# Altium schematic sheet Electronics_Instrumentation.SchDoc
size A; SheetNumber: 1; SheetTotal: 1
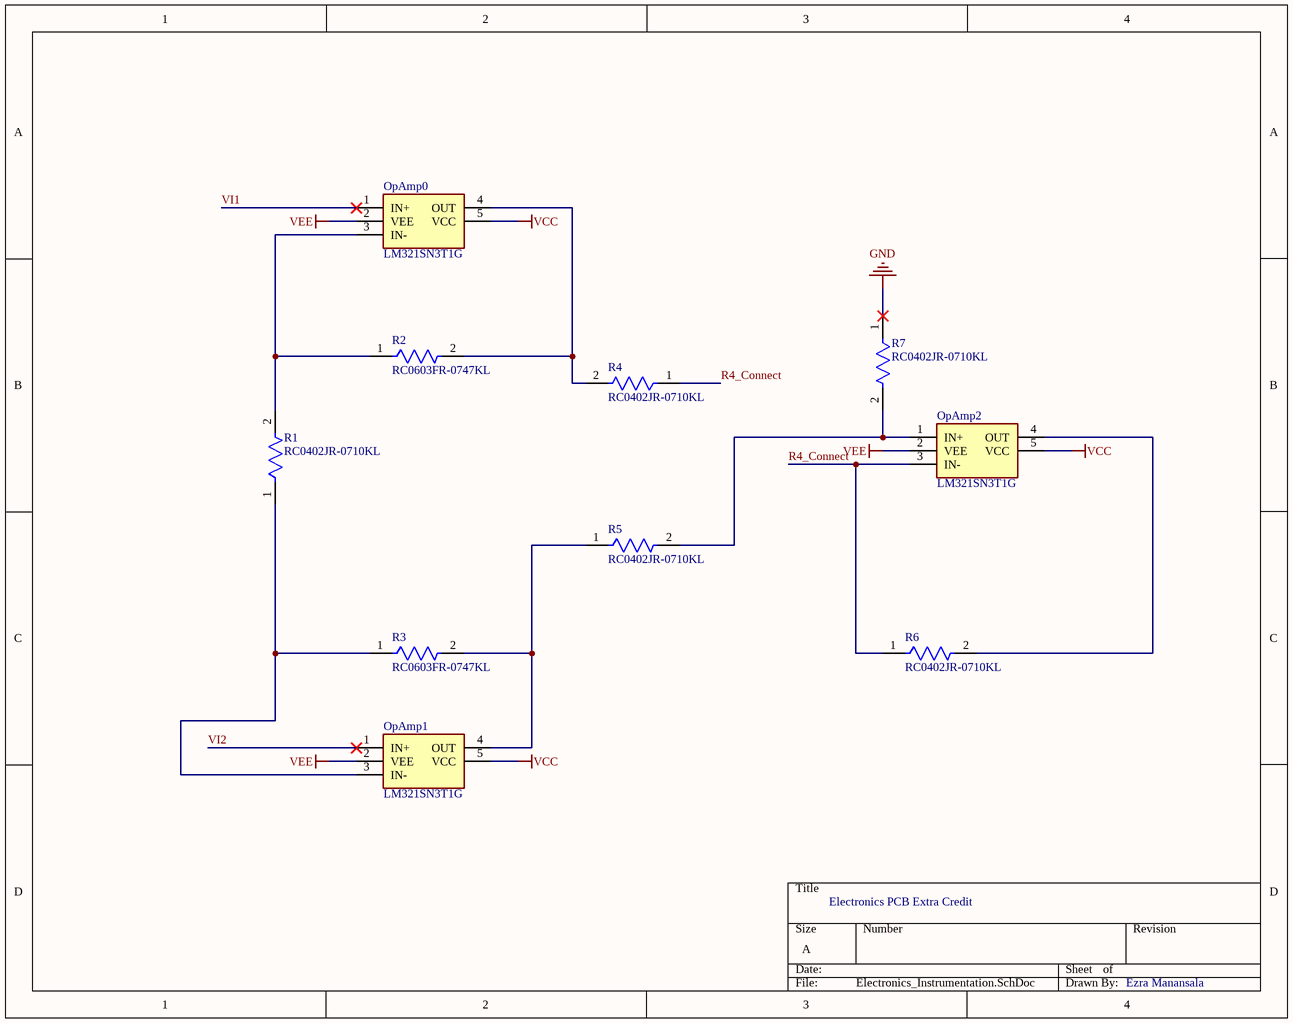
[diagram p0: Electronics_Instrumentation.SchDoc]

## Parts
OpAmp0  LM321SN3T1G  [SOT95P275X110-5N]
OpAmp1  LM321SN3T1G  [SOT95P275X110-5N]
OpAmp2  LM321SN3T1G  [SOT95P275X110-5N]
R1  RC0402JR-0710KL  [FP-RC0402-0_4-IPC_C]
R2  RC0603FR-0747KL  [FP-RC0603FR-0747KL-MFG]
R3  RC0603FR-0747KL  [FP-RC0603FR-0747KL-MFG]
R4  RC0402JR-0710KL  [FP-RC0402-0_4-IPC_C]
R5  RC0402JR-0710KL  [FP-RC0402-0_4-IPC_C]
R6  RC0402JR-0710KL  [FP-RC0402-0_4-IPC_C]
R7  RC0402JR-0710KL  [FP-RC0402-0_4-IPC_C]

## Nets
GND: R7.1
VCC: OpAmp0.5(VCC) OpAmp1.5(VCC) OpAmp2.5(VCC)
VEE: OpAmp0.2(VEE) OpAmp1.2(VEE) OpAmp2.2(VEE)
R4_Connect: OpAmp2.3(IN-) R4.1 R6.1
VI1: OpAmp0.1(IN+)
VI2: OpAmp1.1(IN+)
NetOpAmp0_3: OpAmp0.3(IN-) R1.2 R2.1
NetOpAmp0_4: OpAmp0.4(OUT) R2.2 R4.2
NetOpAmp1_3: OpAmp1.3(IN-) R1.1 R3.1
NetOpAmp1_4: OpAmp1.4(OUT) R3.2 R5.1
NetOpAmp2_1: OpAmp2.1(IN+) R5.2 R7.2
NetOpAmp2_4: OpAmp2.4(OUT) R6.2

## Notes on the sheet
- Electronics PCB Extra Credit
- Ezra Manansala

## Library data of the parts
OpAmp0-OpAmp2 = LM321SN3T1G: Integrated Circuit; Manufacturer_Name: onsemi; Datasheet Link: https://www.onsemi.com/pub/Collateral/LM321-D.PDF; Height: 1.1mm; Manufacturer_Part_Number: LM321SN3T1G; Mouser Part Number: 863-LM321SN3T1G; Mouser Price/Stock: https://www.mouser.co.uk/ProductDetail/onsemi/LM321SN3T1G?qs=slMPpRTKD5qNVsCzBsHVZA%3D%3D; Arrow Part Number: LM321SN3T1G; Arrow Price/Stock: https://www.arrow.com/en/products/lm321sn3t1g/on-semiconductor?utm_currency=USD&region=nac
R1 R4-R7 = CMP-2002-07915-3: RES 10K OHM 5% 1/16W 0402; Max Power Dissipation: 63mW; Temperature Coefficient: 100ppm/°C; Power Rating: 62.5mW; Resistance: 10kR; Voltage Rating: 50V; Size Code: 0402; Resistance Tolerance: 5%; Packaging: Tape and Reel; Case Code (Metric): 1005; Lead Free: Lead Free; Resistor Type: Thick Film; Min Operating Temperature: -55°C; Military Standard: Not; Depth: 0.5mm; Series: RC; Case/Package: 0402; Construction: Rectangular; Number of Terminations: 2; Package Quantity: 1; Termination: SMD/SMT; Length: 0.039inch; Case Code (Imperial): 0402; Height: 0.016inch; Features: Moisture Resistant; RoHS Compliant: Yes; Max Operating Temperature: 155°C; Tolerance: 5%; Width: 0.02inch
R2 R3 = CMP-1659-00055-2: RES SMD 47K OHM 1% 1/10W 0603; Voltage Rating: 50V; Temperature Coefficient: 100ppm/°C; Max Power Dissipation: 100mW; Resistance: 47kR; Voltage Rating (DC): 50V; Min Operating Temperature: -55°C; Packaging: Tape and Reel; Features: Moisture Resistant; Termination: SMD/SMT; Technology: THICK FILM; Lead Free: Lead Free; Max Operating Temperature: 155°C; Width: 0.031inch; Case Code (Metric): 1608; Tolerance: 1%; Package Quantity: 1; Resistor Type: Thick Film; RoHS Compliant: Yes; Case/Package: 0603; Case Code (Imperial): 0603; Resistance Tolerance: 1%; Length: 0.063inch; Series: RC; Number of Pins: 2; Power Rating: 100mW; Number of Terminations: 2; Construction: Rectangular; Height: 0.022inch; Military Standard: Not; Size Code: 0603; Depth: 0.8mm